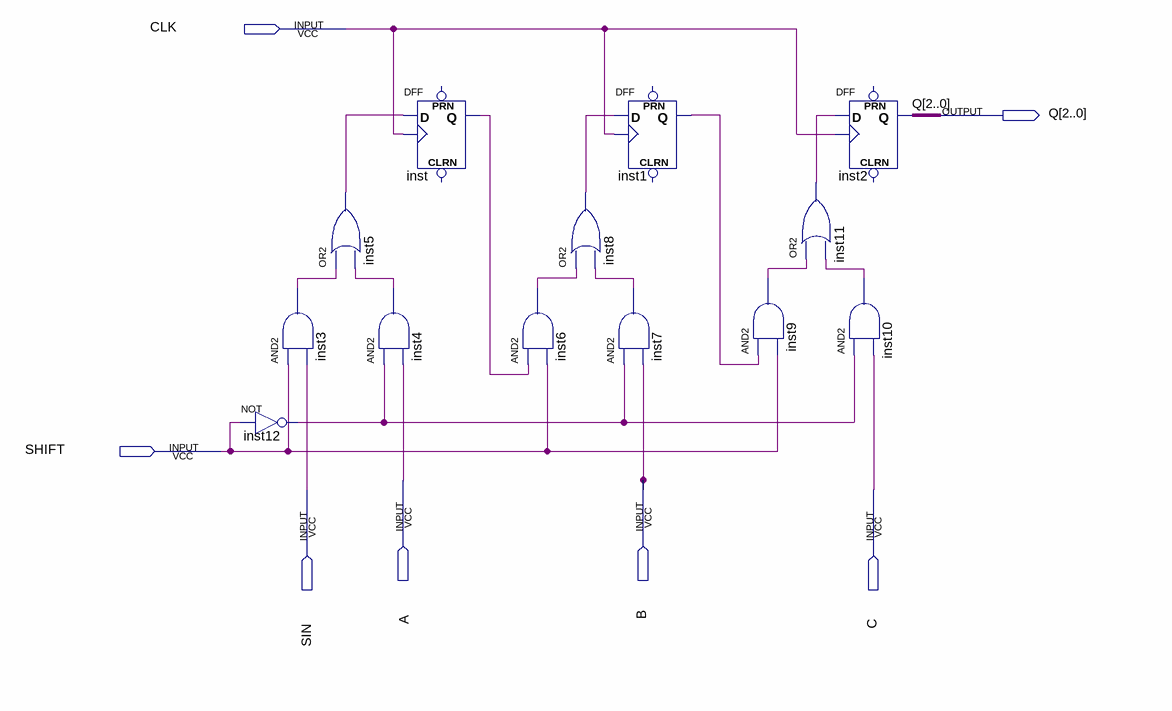
[diagram p0: schematic sheet]
// Quartus schematic piso.bdf as structural Verilog: 13 symbols, 7 pins
module piso (
  input  CLK,
  input  SHIFT,
  input  A,
  input  B,
  input  SIN,
  input  C,
  output [2:0] Q
);

  wire inst1_q, inst3_out, inst4_out, inst5_out, inst6_out, inst7_out, inst8_out, inst9_out, inst10_out,
       inst11_out, inst12_out, inst_q;

  and inst3 (inst3_out, SHIFT, SIN);
  not inst12 (inst12_out, SHIFT);
  or inst5 (inst5_out, inst3_out, inst4_out);
  DFF inst (.CLK(CLK), .D(inst5_out), .Q(inst_q));  // open: CLRN, PRN
  and inst4 (inst4_out, inst12_out, A);
  and inst6 (inst6_out, inst_q, SHIFT);
  or inst8 (inst8_out, inst6_out, inst7_out);
  DFF inst1 (.CLK(CLK), .D(inst8_out), .Q(inst1_q));  // open: CLRN, PRN
  and inst7 (inst7_out, inst12_out, B);
  and inst9 (inst9_out, inst1_q, SHIFT);
  or inst11 (inst11_out, inst9_out, inst10_out);
  DFF inst2[2:0] (.CLK(CLK), .D(inst11_out), .Q(Q));  // open: CLRN, PRN
  and inst10 (inst10_out, inst12_out, C);
endmodule
